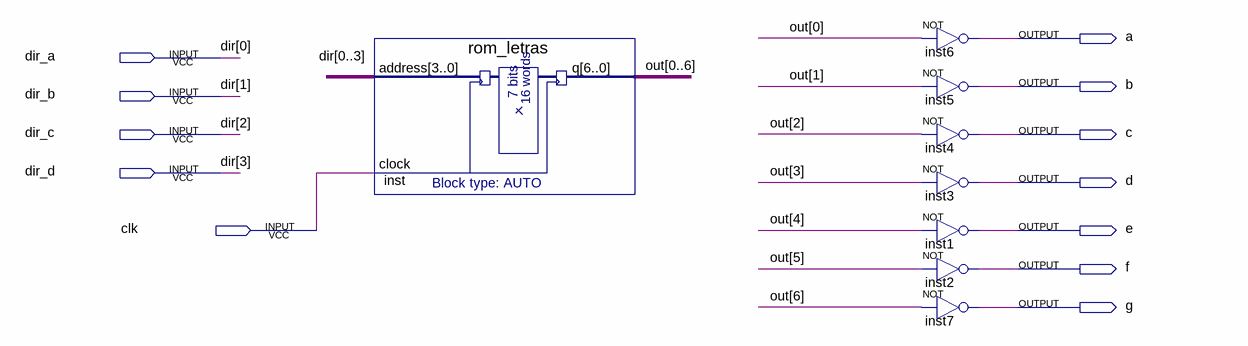
[diagram p0: schematic sheet]
// Quartus schematic bin_a_display.bdf as structural Verilog: 8 symbols, 12 pins
module bin_a_display (
  input  dir_a,
  input  dir_b,
  input  dir_c,
  input  dir_d,
  input  clk,
  output a,
  output b,
  output c,
  output d,
  output e,
  output f,
  output g
);

  wire [6:0] out;

  rom_letras inst (
    .address({dir_a, dir_b, dir_c, dir_d}), .clock(clk),
    .q({out[0], out[1], out[2], out[3], out[4], out[5], out[6]}));
  not inst6 (a, out[0]);
  not inst5 (b, out[1]);
  not inst4 (c, out[2]);
  not inst3 (d, out[3]);
  not inst1 (e, out[4]);
  not inst2 (f, out[5]);
  not inst7 (g, out[6]);

  // Other names for the same wires on the sheet: dir[3:0] = {dir_d, dir_c, dir_b, dir_a}
endmodule
